# EAGLE design MotorControl (EAGLE 9.4.2)
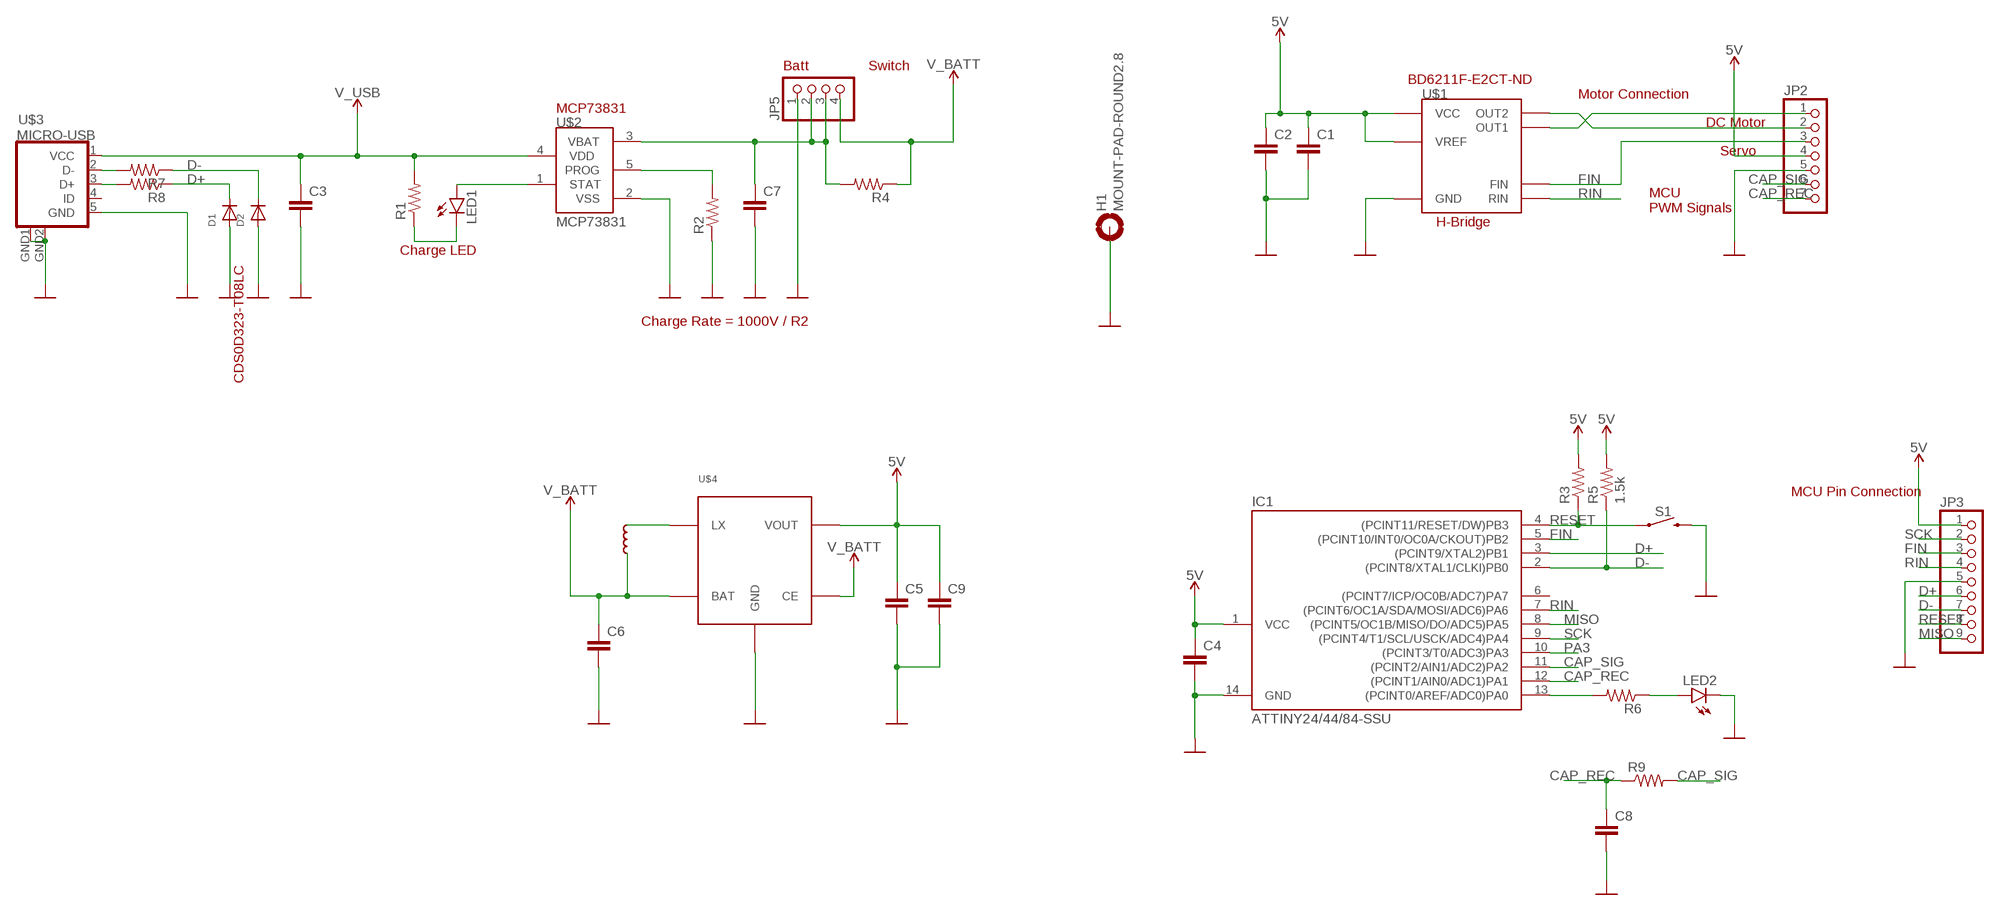
[diagram p0: schematic, sheet 1]

## Parts
C1  C-EUC0603  [C0603]
C2  C-EUC0603  [C0603]
C3  C-EUC0603  [C0603]
C4  C-EUC0603  [C0603]
C5  C-EUC0603  [C0603]
C6  C-EUC0603  [C0603]
C7  C-EUC0603  [C0603]
C8  C-EUC0603  [C0603]
C9  C-EUC0603  [C0603]
D1  DIODESOD-323  [SOD-323]
D2  DIODESOD-323  [SOD-323]
H1  MOUNT-PAD-ROUND2.8  [2,8-PAD]
IC1  ATTINY24/44/84-SSU  [SOIC14]
JP2  HEADER-1X7  [1X07_OVAL]
JP3  HEADER-1X9  [1X09_OVAL]
JP5  HEADER-1X4  [1X04_OVAL]
LED1  LEDCHIP-LED0805  [CHIP-LED0805]
LED2  LEDCHIP-LED0805  [CHIP-LED0805]
R1  R-US_R0603  [R0603]
R2  R-US_R0603  [R0603]
R3  R-US_R0603  [R0603]
R4  R-US_R0603  [R0603]
R5  1.5k  R-US_R0603  [R0603]
R6  R-US_R0603  [R0603]
R7  R-US_R0603  [R0603]
R8  R-US_R0603  [R0603]
R9  R-US_R0603  [R0603]
S1  MOMENTARY-SWITCH-SPST-SMD-5.2MM  [TACTILE_SWITCH_SMD_5.2MM]
U$1  H-BRIDGE-BD6210F  [8-SOP]
U$2  MCP73831  [SOT23-5L]
U$3  MICRO-USB  [MICRO-USB]
U$4  XC9141B50C  [SOT-25]
U$5  INDUCTOR  [SMD_INDUCTOR]

## Nets
5V: C1.1 C2.1 C4.1 C5.1 C9.1 IC1.1(VCC) JP2.4 JP3.1 R3.2 R5.2 U$1.P$2(VCC) U$1.P$3(VCC) U$1.P$6(VREF) U$4.P$4(VOUT)
CAP_REC: C8.1 IC1.12((PCINT1/AIN0/ADC1)PA1) JP2.7 R9.1
CAP_SIG: IC1.11((PCINT2/AIN1/ADC2)PA2) JP2.6 R9.2
D+: D1.C IC1.3((PCINT9/XTAL2)PB1) JP3.6 R8.1
D-: D2.C IC1.2((PCINT8/XTAL1/CLKI)PB0) JP3.7 R5.1 R7.1
FIN: IC1.5((PCINT10/INT0/OC0A/CKOUT)PB2) JP2.3 JP3.3 U$1.P$4(FIN)
GND: C1.2 C2.2 C3.2 C4.2 C5.2 C6.2 C7.2 C8.2 C9.2 D1.A D2.A H1.B2,8(MOUNT) IC1.14(GND) JP2.5 JP3.5 JP5.1 LED2.C R2.1 S1.3 U$1.P$8(GND) U$2.2(VSS) U$3.5(GND) U$3.GND1(GND) U$3.GND2(GND) U$4.P$2(GND)
MISO: IC1.8((PCINT5/OC1B/MISO/DO/ADC5)PA5) JP3.9
N$1: LED2.A R6.1
N$2: R7.2 U$3.2(D-)
N$3: LED1.C R1.1
N$4: LED1.A U$2.1(STAT)
N$5: JP2.1 U$1.P$1(OUT1)
N$6: JP2.2 U$1.P$7(OUT2)
N$7: R8.2 U$3.3(D+)
N$9: IC1.13((PCINT0/AREF/ADC0)PA0) R6.2
N$15: R2.2 U$2.5(PROG)
N$16: C7.1 JP5.2 JP5.3 R4.2 U$2.3(VBAT)
N$21: U$4.P$5(LX) U$5.P$2
PA3: IC1.10((PCINT3/T0/ADC3)PA3)
RESET: IC1.4((PCINT11/RESET/DW)PB3) JP3.8 R3.1 S1.1
RIN: IC1.7((PCINT6/OC1A/SDA/MOSI/ADC6)PA6) JP3.4 U$1.P$5(RIN)
SCK: IC1.9((PCINT4/T1/SCL/USCK/ADC4)PA4) JP3.2
V_BATT: C6.1 JP5.4 R4.1 U$4.P$1(CE) U$4.P$3(BAT) U$5.P$1
V_USB: C3.1 R1.2 U$2.4(VDD) U$3.1(VCC)
Unconnected: IC1.6((PCINT7/ICP/OC0B/ADC7)PA7) U$3.4(ID)

## Notes on the sheet
- Batt | Switch
- BD6211F-E2CT-ND | Motor Connection
- MCP73831
- DC Motor
- Servo
- MCU
  PWM Signals
- H-Bridge
- Charge LED
- Charge Rate = 1000V / R2
- CDS0D323-T08LC
- MCU Pin Connection

## Library data of the parts
C1-C9 = rcl:C-EU: CAPACITOR, European symbol; SPICEPREFIX: C
D1 D2 = microbuilder:DIODE: Diode SMA Model Volts Amps Type Vf Vr Digikey # Notes SSA34-E3 40V 3A Schottky 480mV @ 3A 200uA @ 40V SSA34-E3/61TGITR-ND CDBA120-G 20V 1A Schottky 500mV @ 1A 500uA @ 20V 641-1014-6-ND REEL MBRA210 10V 2A Schottky 350mV @ 2A 700uA @ 10V MBRA210LT3 SOD-123 Model Volts Amps Type Vf Vr Order # Notes BAT54T1G 30V 200mA Schottky 800mV @ 200mA 2uA @ 25V BAT54T1GOSTR-ND B0530W 30V 500mA Schottky 430mV @ 500mA 130uA @ 30V B0530W-FDICT-ND REEL MBR120 1A 20V Schottky 340mV @ 1A MBR120VLSFT1GOSCT-ND SOD-323 Model Volts Amps Type Vf Vr Order # Notes PMEG2005EJ 20V 500mA Schottky 355mV @ 500mA 568-4110-1-ND ZLLS410 10V 570mA Schottky 380mV @ 570mA ZLLS410CT-ND 1N4148WS 75V 150mA Silicon/Simple 1V 1N4148WSFSCT-ND REEL SOD-523 Model Volts Amps Type Vf Vr Order # Notes BAT54XV2 30V 200mA Schottky 0.8V @ 100mA BAT54XV2CT-ND TB751S 30V 30mA Schottky RB751S-40TE61CT-ND SOT23-R/W (R = Solder Paste/Reflow Ovens, W = Hand-Soldering) Model Volts Amps Type Vf Vr Order # Notes BAT54FILM 40V 300mA Schottky 497-7162-1-ND
H1 = holes:MOUNT-PAD-ROUND: MOUNTING PAD, round
IC1 = attiny24_44_84:ATTINY24/44/84
JP2 = microbuilder:HEADER-1X7: PIN HEADER
JP3 = microbuilder:HEADER-1X9: PIN HEADER
JP5 = microbuilder:HEADER-1X4: PIN HEADER
LED1 LED2 = led:LED: LED OSRAM: - CHIPLED LG R971, LG N971, LY N971, LG Q971, LY Q971, LO R971, LY R971 LH N974, LH R974 LS Q976, LO Q976, LY Q976 LO Q996 - Hyper CHIPLED LW Q18S LB Q993, LB Q99A, LB R99A - SideLED LS A670, LO A670, LY A670, LG A670, LP A670 LB A673, LV A673, LT A673, LW A673 LH A674 LY A675 LS A676, LA A676, LO A676, LY A676, LW A676 LS A679, LY A679, LG A679 - Hyper Micro SIDELED® LS Y876, LA Y876, LO Y876, LY Y876 LT Y87S - SmartLED LW L88C, LW L88S LB L89C, LB L89S, LG L890 LS L89K, LO L89K, LY L89K LS L896, LA L896, LO L896, LY L896 - TOPLED LS T670, LO T670, LY T670, LG T670, LP T670 LSG T670, LSP T670, LSY T670, LOP T670, LYG T670 LG T671, LOG T671, LSG T671 LB T673, LV T673, LT T673, LW T673 LH T674 LS T676, LA T676, LO T676, LY T676, LB T676, LH T676, LSB T676, LW T676 LB T67C, LV T67C, LT T67C, LS T67K, LO T67K, LY T67K, LW E67C LS E67B, LA E67B, LO E67B, LY E67B, LB E67C, LV E67C, LT E67C LW T67C LS T679, LY T679, LG T679 LS T770, LO T770, LY T770, LG T770, LP T770 LB T773, LV T773, LT T773, LW T773 LH T774 LS E675, LA E675, LY E675, LS T675 LS T776, LA T776, LO T776, LY T776, LB T776 LHGB T686 LT T68C, LB T68C - Hyper Mini TOPLED® LB M676 - Mini TOPLED Santana® LG M470 LS M47K, LO M47K, LY M47K Source: http://www.osram.convergy.de LUXEON: - LUMILED® LXK2-PW12-R00, LXK2-PW12-S00, LXK2-PW14-U00, LXK2-PW14-V00 LXK2-PM12-R00, LXK2-PM12-S00, LXK2-PM14-U00 LXK2-PE12-Q00, LXK2-PE12-R00, LXK2-PE12-S00, LXK2-PE14-T00, LXK2-PE14-U00 LXK2-PB12-K00, LXK2-PB12-L00, LXK2-PB12-M00, LXK2-PB14-N00, LXK2-PB14-P00, LXK2-PB14-Q00 LXK2-PR12-L00, LXK2-PR12-M00, LXK2-PR14-Q00, LXK2-PR14-R00 LXK2-PD12-Q00, LXK2-PD12-R00, LXK2-PD12-S00 LXK2-PH12-R00, LXK2-PH12-S00 LXK2-PL12-P00, LXK2-PL12-Q00, LXK2-PL12-R00 Source: www.luxeon.com KINGBRIGHT: KA-3528ASYC Source: www.kingbright.com
R1-R9 = rcl:R-US_: RESISTOR, American symbol; SPICEPREFIX: R
S1 = SparkFun-Switches:MOMENTARY-SWITCH-SPST: Momentary Switch (Pushbutton) - SPST Normally-open (NO) SPST momentary switches (buttons, pushbuttons). Variants PTH-12MM - 12mm square, through-hole Momentary Pushbutton Switch - 12mm Square <https://www.sparkfun.com/products/9190> (COM-09190) PTH-6.0MM, PTH-6.0MM-KIT - 6.0mm square, through-hole Mini Pushbutton Switch <https://www.sparkfun.com/products/97> (COM-00097) KIT package intended for soldering kit's - only one side of pads' copper is exposed. PTH-RIGHT-ANGLE-KIT - Right-angle, through-hole Right Angle Tactile Button <https://www.sparkfun.com/products/10791> - Used on SparkFun BigTime Watch Kit <https://www.sparkfun.com/products/11734> SMD-12MM - 12mm square, surface-mount Tactile Button - SMD (12mm) <https://www.sparkfun.com/products/12993> (COM-12993) Used on SparkFun PicoBoard <https://www.sparkfun.com/products/11888> SMD-4.5MM - 4.5mm Square Trackball Switch Used on SparkFun Blackberry Trackballer Breakout <https://www.sparkfun.com/products/13169> SMD-4.6MMX2.8MM - 4.60mm x 2.80mm, surface mount Used on SparkFun SAMD21 Mini Breakout <https://www.sparkfun.com/products/13664> SMD-5.2MM, SMD-5.2-REDUNDANT - 5.2mm square, surface-mount Mini Pushbutton Switch - SMD <https://www.sparkfun.com/products/8720> (COM-08720) Used on Arduino Pro Mini <https://www.sparkfun.com/products/11114> REDUNDANT package connects both switch circuits together SMD-6.0X3.5MM - 6.0 x 3.5mm, surface mount Momentary Reset Switch SMD <https://www.sparkfun.com/products/8229> (COM-08229) SMD-6.2MM-TALL - 6.2mm square, surface mount Tactile Button - SMD (6mm) <https://www.sparkfun.com/products/12992> Used on SparkFun Digital Sandbox <https://www.sparkfun.com/products/12651> SMD-RIGHT-ANGLE - Right-angle, surface mount Used on SparkFun Block for Intel® Edison - Arduino <https://www.sparkfun.com/products/13036>; PROD_ID: SWCH-08247; SF_SKU: COM-08720
U$1 = Nick's Personal Part:H-BRIDGE-BD6210F
U$2 = mcp73831:MCP73831: Miniature Single-Cell, Fully Integrated Li-Ion, Li-Polymer Charge Management Controllers
U$3 = MicroUSB:MICRO-USB: Micro USB B connector
U$4 = Nick's Personal Part:XC9141B50C: XC9141B50CMR-G - Torex Semiconductor Technical Specifications: DC to DC Voltage Booster Vout : 5v Current Output: 800mA Inductor: 4.7 uH Digikey: 893-1369-1-ND
U$5 = Nick's Personal Part:INDUCTOR: 74405024047 - Wurth Electronics Technical Specifications: Inductance: 4.7UH Current: 1A Resistance: 270M OHM MAX Digikey: 732-10778-1-ND

## Board
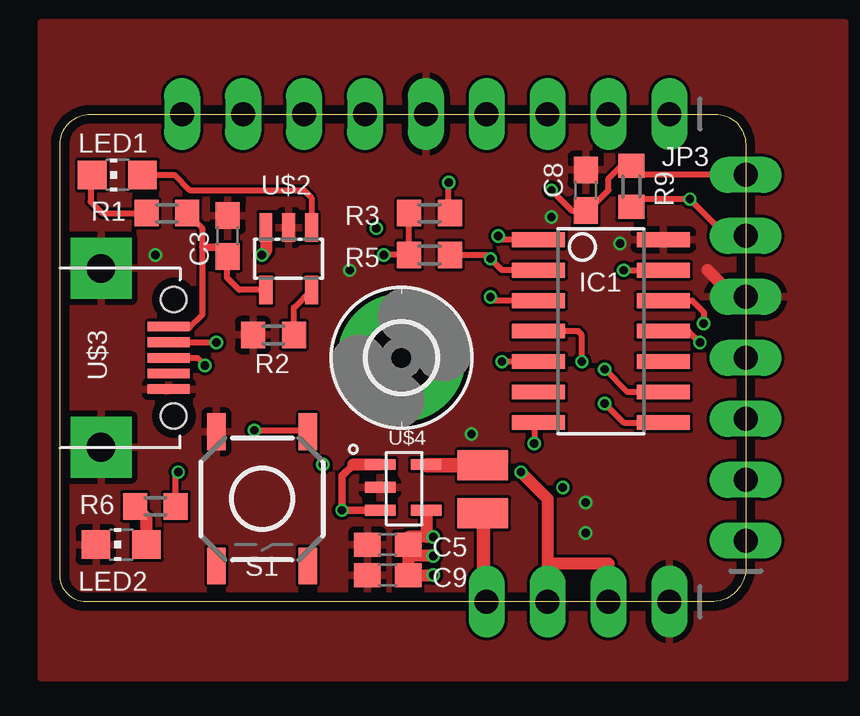
[diagram p1: board, top side]
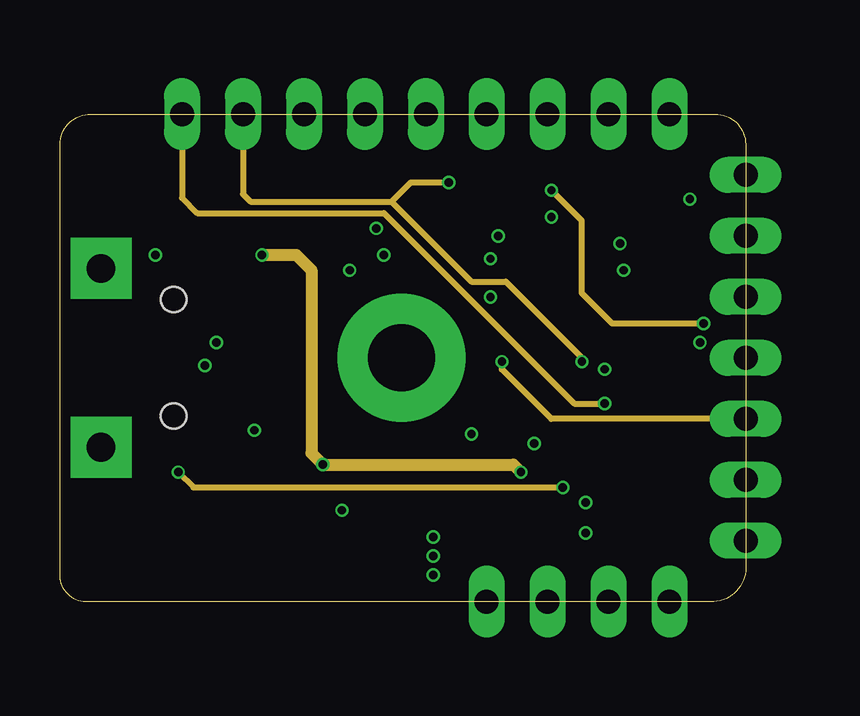
[diagram p2: board, inner layer Inner1]
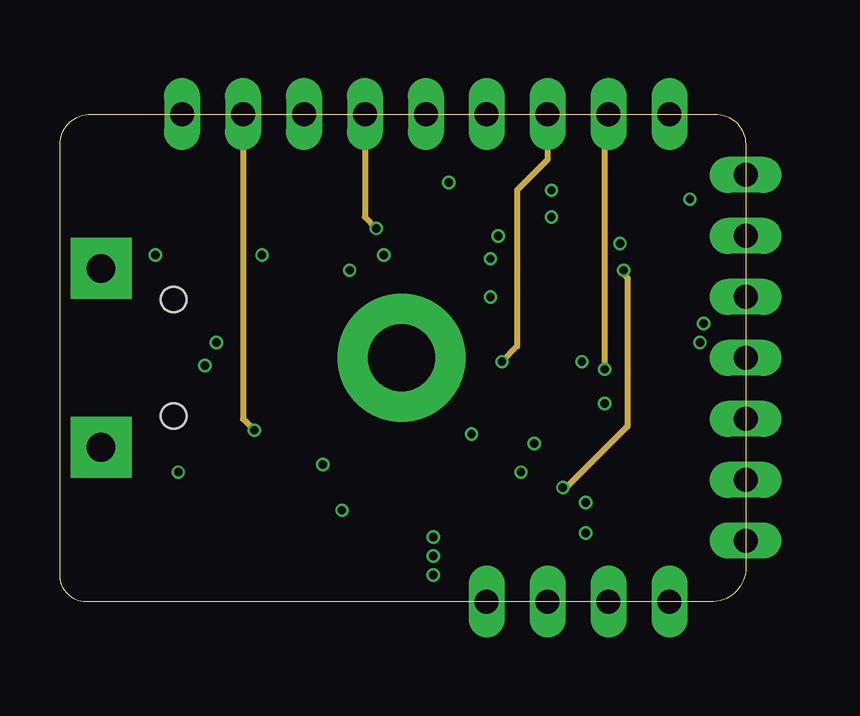
[diagram p3: board, inner layer Inner2]
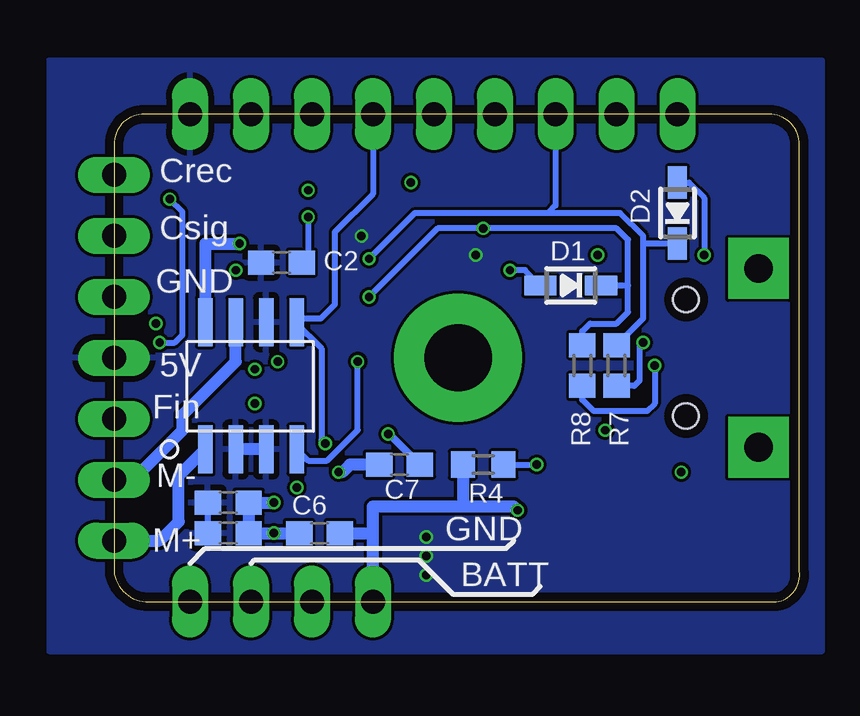
[diagram p4: board, bottom side, seen from below]

Size 28.59 x 20.33 mm. Coordinates in mm from the lower left corner, seen from the top.
Outline: 0.96,0.01 arc-90 0.01,1.28 0.01,19.06 arc-90 1.28,20.33 27.32,20.33 arc-90 28.59,19.06 28.59,1.28 arc-90 27,0.01 0.96,0.01
Copper layers (1*2*15*16): Top 0.035559375mm / dielectric 0.17018125mm / Inner1 0.01778125mm / dielectric 47mil / Inner2 0.01778125mm / dielectric 0.17018125mm / Bottom 0.035559375mm
Design rules "oshpark-4layer": minimum track width 5mil, minimum drill 10mil, track to track 5mil, track to pad 5mil, pad to pad 5mil, via to via 5mil, smd to smd 5mil, copper to edge 15mil, drill to drill 6mil, minimum pad ring 4mil, minimum via ring 4mil, stop-mask expansion 2.5mil, vias tented up to drill 0mil, thermal gap 10mil

### Footprints (pad centres in the part's own frame; a part is rotated, then mirrored left to right if it is on the bottom)
C0603 = smd 1.1 x 1: 1 -0.85,0; 2 0.85,0
SOD-323 = smd 1.35 x 0.8: A 1.27,0; C -1.27,0
2,8-PAD = drill 2.8 pad 5.334: B2,8 0,0
SOIC14 = smd 0.61 x 2.21: 1 -3.81,-2.603; 2 -2.54,-2.603; 3 -1.27,-2.603; 4 0,-2.603; 5 1.27,-2.603; 6 2.54,-2.603; 7 3.81,-2.603; 8 3.81,2.603; 9 2.54,2.603; 10 1.27,2.603; 11 0,2.603; 12 -1.27,2.603; 13 -2.54,2.603; 14 -3.81,2.603
1X07_OVAL = drill 1 long: 1 -7.62,0; 2 -5.08,0; 3 -2.54,0; 4 0,0; 5 2.54,0; 6 5.08,0; 7 7.62,0
1X09_OVAL = drill 1 long: 1 -10.16,0; 2 -7.62,0; 3 -5.08,0; 4 -2.54,0; 5 0,0; 6 2.54,0; 7 5.08,0; 8 7.62,0; 9 10.16,0
1X04_OVAL = drill 1 long: 1 -3.81,0; 2 -1.27,0; 3 1.27,0; 4 3.81,0
CHIP-LED0805 = smd 1.2 x 1.2: A 0,-1.05; C 0,1.05
R0603 = smd 1 x 1.1: 1 -0.85,0; 2 0.85,0
TACTILE_SWITCH_SMD_5.2MM = smd 1.524 x 0.762: 1 -2.794,1.905; 2 2.794,1.905; 3 -2.794,-1.905; 4 2.794,-1.905
8-SOP = smd 0.6 x 2: P$1 -1.27,-2.54; P$2 0,-2.54; P$3 1.27,-2.54; P$4 2.54,-2.54; P$5 2.54,2.76; P$6 1.27,2.76; P$7 0,2.76; P$8 -1.27,2.76
SOT23-5L = smd 0.533 x 1.2: 1 -0.95,-1.3; 2 0,-1.3; 3 0.95,-1.3 | smd 0.55 x 1.2: 4 0.95,1.3; 5 -0.95,1.3
MICRO-USB = smd 0.4 x 1.75: 1 -1.3,4.525; 2 -0.65,4.525; 3 0,4.525; 4 0.65,4.525; 5 1.3,4.525 | drill 1.2 pad 2.54 square: GND1 -3.725,1.7; GND2 3.725,1.7 | hole 1.05: -2.425,4.73; 2.425,4.73
SOT-25 = smd 1.27 x 0.45: P$1 0,0; P$2 0,-0.95; P$3 0,-1.9; P$4 1.92,-1.9; P$5 1.92,0
SMD_INDUCTOR = smd 1.25 x 2.1: P$1 -0.125,0; P$2 1.87,0

### Placement (x,y rotation side)
C1  23.82,2.87 0 bottom
C2  21.6,14.14 0 bottom
C3  7,15.25 90 top
C4  23.82,4.14 0 bottom
C5  13.66,2.39 180 top
C6  20.01,2.87 180 bottom
C7  16.68,5.72 0 bottom
C8  21.92,17.15 90 top
C9  13.66,1.12 180 top
D1  9.54,13.18 180 bottom
D2  5.09,16.2 90 bottom
H1  14.23,10.17 0 top
IC1  22.55,11.28 270 top
JP2  28.59,10.17 90 top
JP3  15.25,20.33 180 top
JP5  21.6,0.01 180 top
LED1  2.39,17.79 90 top
LED2  2.55,2.39 90 top
R1  4.46,16.2 0 top
R2  8.9,11.12 0 top
R3  15.41,16.2 180 top
R4  13.19,5.72 0 bottom
R5  15.41,14.45 180 top
R6  3.98,3.98 0 top
R7  7.63,9.85 270 bottom
R8  9.06,9.85 270 bottom
R9  23.82,17.31 270 top
S1  8.42,4.29 270 top
U$1  23.51,8.9 0 bottom
U$2  9.54,14.3 180 top
U$3  0.01,10.17 270 top
U$4  13.35,5.72 0 top
U$5  17.63,3.82 90 top

### Tracks (layer width: path | path; a pad name or v marks a point on that pad's centre or on a via)
5V  (via drill 0.35)
  Top 0.254: 15.31,3.78 U$4.P$4 | R3.2 R5.2 v13.5,14.45 | IC1.1 18.43,15.09 v18.27,15.25 | v15.57,2.71 15.31,2.71
  Top 0.305: 14.51,2.71 C5.1 14.51,1.91
  Top 0.508: 15.31,3.78 15.31,2.71 14.51,2.71 | v15.57,1.91 14.51,1.91 | C5.1 C9.1 v15.57,1.12
  Bottom 0.254: C4.1 C1.1
  Bottom 0.508: U$1.P$3 U$1.P$2
  pour Bottom: -0.94,-2.06 -0.94,22.55 31.28,22.55 31.28,-2.06
CAP_REC  (via drill 0.35)
  Top 0.254: JP2.7 24.2,17.79 R9.1 23.4,18.16 22.87,17.63 22.87,17.15 22.02,16.3 C8.1 21.34,16.3 v20.49,17.15 | IC1.12 26.36,12.55 26.84,12.07 v26.84,11.6
  Inner1 0.254: v26.84,11.6 23.03,11.6 21.76,12.87 21.76,15.88 v20.49,17.15
CAP_SIG  (via drill 0.35)
  Top 0.254: JP2.6 27.79,15.25 v26.26,16.78 24.14,16.78 R9.2 | IC1.11 26.2,11.28 v26.68,10.8
  Bottom 0.254: v26.68,10.8 26.05,10.8 25.73,11.12 25.73,16.25 v26.26,16.78
D+  (via drill 0.35)
  Top 0.254: IC1.3 18.11,12.55 v17.95,12.71
  Inner2 0.254: JP3.6 12.71,16.04 v13.19,15.57
  Bottom 0.254: 9.22,10.7 R8.1 9.06,11.28 8.74,11.6 7.63,11.6 7.15,12.07 7.15,13.18 | 7.15,13.18 7.15,15.09 7.63,15.57 v13.19,15.57 15.09,15.57 v17.95,12.71 | D1.C 7.15,13.18
D-  (via drill 0.35)
  Top 0.254: IC1.2 18.43,13.82 v17.95,14.3 17.79,14.45 R5.1
  Bottom 0.254: R7.1 6.52,11.81 6.52,14.93 | 6.52,14.93 6.52,15.25 7.47,16.2 10.49,16.2 | D2.C 6.52,14.93 | v17.95,14.3 16.04,16.2 13.35,16.2 10.49,16.2 | JP3.7 10.17,16.52 10.49,16.2
FIN  (via drill 0.35)
  Top 0.254: IC1.5 v18.43,10.01
  Inner1 0.254: JP2.3 20.49,7.63 18.43,9.69 v18.43,10.01
  Inner2 0.254: JP3.3 20.33,18.42 19.06,17.15 19.06,10.64 v18.43,10.01
  Bottom 0.254: U$1.P$4 20.49,5.88 19.7,5.88 18.43,7.15 v18.43,10.01
GND  (via drill 0.35)
  Top 0.508: JP2.5 28.11,12.71 27,13.82
  Bottom 0.254: C2.2 20.49,14.14 v20.49,16.04 | D2.A 4.61,17.47 3.98,16.84 v3.98,14.45 | D1.A 11.44,13.82 v12.08,13.82
  Bottom 0.305: C7.2 17.1,6.99 v17.16,6.99
  Bottom 0.508: C6.2 v21.92,2.87 C1.2 C4.2 v21.92,4.14 | U$1.P$8 24.78,14.93 v23.35,14.93
  pour Top: -0.78,24.14 -0.78,-3.17 32.71,-3.17 32.71,24.14
MISO  (via drill 0.35)
  Top 0.254: v22.71,8.26 23.51,7.47 IC1.8
  Inner1 0.254: JP3.9 5.09,16.84 5.73,16.2 13.5,16.2 21.44,8.26 v22.71,8.26
N$1
  Top 0.508: R6.1 3.6,3.51 LED2.A
N$2  (via drill 0.35)
  Top 0.254: U$3.2 v6.52,10.82 v6.52,10.8
  Bottom 0.254: v6.52,10.8 6.68,10.64 6.68,9.22 6.89,9 R7.2
N$3
  Top 0.254: LED1.C 1.28,17.73 1.28,16.68 1.76,16.2 R1.1
N$4
  Top 0.254: LED1.A 4.77,17.79 5.41,17.15 10.17,17.15 10.49,16.84 U$2.1
N$5
  Bottom 0.508: JP2.1 26.68,2.55 25.89,3.34 25.89,5.25 U$1.P$1
N$6
  Bottom 0.508: JP2.2 27.79,5.09 25.73,7.15 25.73,7.79 23.51,10.01 U$1.P$7
N$7  (via drill 0.35)
  Top 0.254: U$3.3 5.73,10.17 v6.04,9.85
  Bottom 0.254: v6.04,9.85 6.04,8.26 6.36,7.95 8.58,7.95 9.06,8.42 R8.2
N$9  (via drill 0.35)
  Top 0.254: R6.2 4.83,5.3 v4.93,5.41 | v23.51,13.82 IC1.13
  Inner1 0.254: v4.93,5.41 5.57,4.77 v20.97,4.77
  Inner2 0.254: v20.97,4.77 21.12,4.77 23.66,7.31 23.66,13.5 23.51,13.66 v23.51,13.82
N$15
  Top 0.254: R2.2 9.75,12.26 U$2.5
N$16  (via drill 0.35)
  Top 0.508: U$2.3 8.59,14.62 v8.42,14.45 | v19.22,5.41 20.33,4.29 20.33,1.6 | 20.33,1.6 20.33,0.8 20.33,0.52 JP5.3 | JP5.2 22.87,1.6 20.33,1.6
  Inner1 0.508: v19.22,5.41 18.9,5.72 v10.96,5.72 10.49,6.2 10.49,13.82 9.85,14.45 v8.42,14.45
  Bottom 0.254: R4.2 v10.96,5.72
  Bottom 0.305: 19.06,5.41 v19.22,5.41
  Bottom 0.508: C7.1 18.74,5.72 19.06,5.41
N$21
  Top 0.254: 15.3,5.69 U$4.P$5
  Top 0.61: U$5.P$2 15.3,5.69
RESET  (via drill 0.35)
  Top 0.254: v21.76,10.01 21.76,11.12 21.6,11.28 IC1.4 | R3.1 16.2,16.26 v16.2,17.47 | v8.11,7.15 10.27,7.15 S1.1
  Inner1 0.254: JP3.8 7.63,16.99 7.95,16.68 13.82,16.68 | v21.76,10.01 21.76,10.17 18.58,13.34 17.16,13.34 13.82,16.68 | v16.2,17.47 14.62,17.47 13.82,16.68
  Inner2 0.254: JP3.8 7.63,7.63 v8.11,7.15
RIN  (via drill 0.35)
  Top 0.254: 19.69,7.47 19.7,7.47 IC1.7 20.01,7.47 19.77,7.23 v19.77,6.6
  Bottom 0.254: v19.77,6.6 19.93,6.76 19.93,10.57 21.03,11.66 U$1.P$5 20.87,11.66 20.71,11.82 19.95,11.82 19.38,12.39 19.38,15.41 17.79,16.99 JP3.4
SCK  (via drill 0.35)
  Top 0.254: IC1.9 23.66,8.74 v22.71,9.69
  Inner2 0.254: v22.71,9.69 22.71,19.53 22.87,19.53 JP3.2
V_BATT  (via drill 0.35)
  Top 0.254: 17.67,3.66 U$5.P$1
  Top 0.305: 17.63,0.17 JP5.4 17.79,3.53 17.67,3.66 | U$4.P$3 v11.76,3.82 11.76,5.25 12.23,5.72
  Top 0.508: U$4.P$1 12.23,5.72 | 17.63,0.17 U$5.P$1
  Bottom 0.305: R4.1 14.04,5.46 | 13.98,3.98 14.04,4.03 | 11.92,3.98 v11.76,3.82
  Bottom 0.508: JP5.4 17.79,2.87 | 17.79,2.87 17.79,3.98 13.98,3.98 11.92,3.98 | C6.1 17.79,2.87 | R4.1 14.04,4.03
V_USB
  Top 0.254: U$3.1 4.57,11.44 5.41,11.44 5.94,11.97 5.94,14.77 5.94,15.57 R1.2 5.41,16.1 | U$2.4 7.47,13 6.95,13.52 6.95,14.29 7,14.33 C3.1
  Top 0.305: C3.1 6.62,14.77 5.94,14.77

### Text on the board
bNames: Crec | Csig | GND | 5V | Fin | M- | GND | M+ | BATT